# Altium schematic sheet SD_Card.SchDoc
size A; SheetNumber: 10; SheetTotal: 10
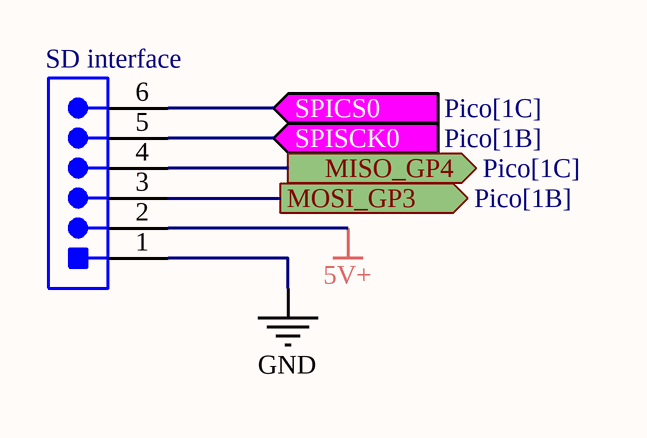
[diagram p0: SD_Card.SchDoc]

## Parts
SD_interface  SD Card  [SMTC-TSW-106-07-S-S_V]  (value not drawn)

## Ports
MISO_GP4 (out, see Pico[1C]), MOSI_GP3 (out, see Pico[1B]), SPICS0 (in, see Pico[1C]), SPISCK0 (in, see Pico[1B])

## Nets
5V+: SD_interface.2
GND: SD_interface.1
MISO_GP4: SD_interface.4 ; port MISO_GP4
MOSI_GP3: SD_interface.3 ; port MOSI_GP3
SPICS0: SD_interface.6 ; port SPICS0
SPISCK0: SD_interface.5 ; port SPISCK0

## Library data of the parts
SD_interface = CMP-1681-00007-2: Male Header, Pitch 2.54 mm, 1 x 6 Position, Height 8.38 mm, Tail Length 2.54 mm, -55 to 125 degC, RoHS, Bulk; Manufacturer: Samtec; Rows: 1; Contact Finish: Gold; Lead Pitch: 0.1 inch; Package Quantity: 1; Mounting Technology: Through Hole; ComponentLink1Description: Manufacturer URL; Contact Plating: Gold; DatasheetVersion: 12/2015; ComponentLink3Description: Package Specification; PackageDescription: Male Header, Pitch 2.54 mm, 1 x 6 Position, Height 8.38 mm, Tail Length 2.54 mm; Height: 8.38 mm; ComponentLink2Description: Datasheet; RoHSCompliant: true; Colour: Black; Packaging: Bulk; Min Operating Temperature: -55 degC; ComponentLink2URL: http://suddendocs.samtec.com/catalog_english/tsw_th.pdf; Mount: Through Hole; PackageReference: TSW-102-07-S-S; Pins: 6; Max Operating Temperature: 125 degC; ComponentLink3URL: http://suddendocs.samtec.com/prints/tsw-xxx-xx-x-x-xx-xxx-footprint.pdf; Length: 15.24 mm; Contact Material: Bronze; ComponentLink1URL: http://www.samtec.com/